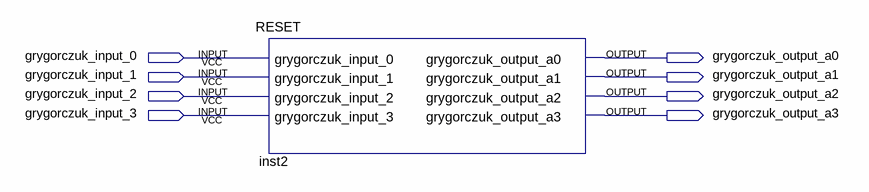
[diagram p0: schematic sheet]
// Quartus schematic RESET_SYMBOL.bdf as structural Verilog: 1 symbols, 8 pins
module RESET_SYMBOL (
  input  grygorczuk_input_0,
  input  grygorczuk_input_1,
  input  grygorczuk_input_2,
  input  grygorczuk_input_3,
  output grygorczuk_output_a0,
  output grygorczuk_output_a1,
  output grygorczuk_output_a2,
  output grygorczuk_output_a3
);

  RESET inst2 (
    .grygorczuk_input_0(grygorczuk_input_0), .grygorczuk_input_1(grygorczuk_input_1),
    .grygorczuk_input_2(grygorczuk_input_2), .grygorczuk_input_3(grygorczuk_input_3),
    .grygorczuk_output_a0(grygorczuk_output_a0), .grygorczuk_output_a1(grygorczuk_output_a1),
    .grygorczuk_output_a2(grygorczuk_output_a2), .grygorczuk_output_a3(grygorczuk_output_a3));
endmodule
